# EAGLE design Dual_line_PS (EAGLE 9.6.2)
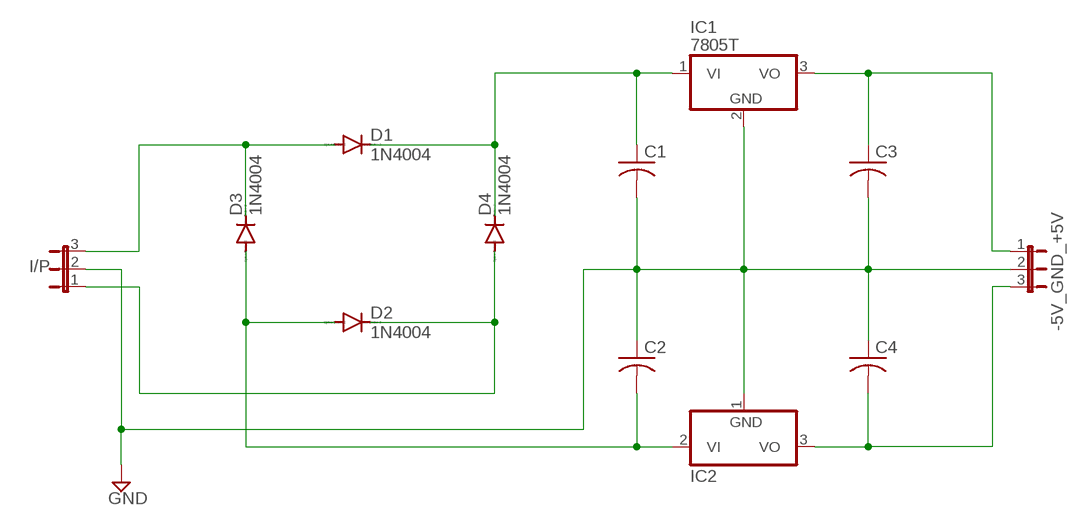
[diagram p0: schematic, sheet 1]

## Parts
-5V_GND_+5V  JP2E  [JP2]
C1  C-US025-024X044  [C025-024X044]
C2  C-US025-024X044  [C025-024X044]
C3  C-US025-024X044  [C025-024X044]
C4  C-US025-024X044  [C025-024X044]
D1  1N4004  [DO41-10]
D2  1N4004  [DO41-10]
D3  1N4004  [DO41-10]
D4  1N4004  [DO41-10]
I/P  JP2E  [JP2]
IC1  7805T  [TO220H]
IC2  7905T  [TO220H]

## Nets
GND: -5V_GND_+5V.2 C1.2 C2.1 C3.2 C4.1 I/P.2 IC1.2(GND) IC2.1(GND)
N$1: D1.A D3.C I/P.3
N$3: D2.C D4.A I/P.1
N$4: C2.2 D2.A D3.A IC2.2(VI)
N$7: C1.1 D1.C D4.C IC1.1(VI)
N$9: -5V_GND_+5V.3 C4.2 IC2.3(VO)
N$10: -5V_GND_+5V.1 C3.1 IC1.3(VO)

## Library data of the parts
-5V_GND_+5V I/P = jumper:JP2E: JUMPER
C1-C4 = rcl:C-US: CAPACITOR, American symbol; SPICEPREFIX: C
D1-D4 = diode:1N4004: DIODE general purpose rectifier, 1 A
IC1 = linear:78*: Positive VOLTAGE REGULATOR Source: http://cache.national.com/ds/LM/LM78L05.pdf http://www.fairchildsemi.com/ds/LM/LM7805.pdf
IC2 = linear:79*: Negative VOLTAGE REGULATOR

## Board
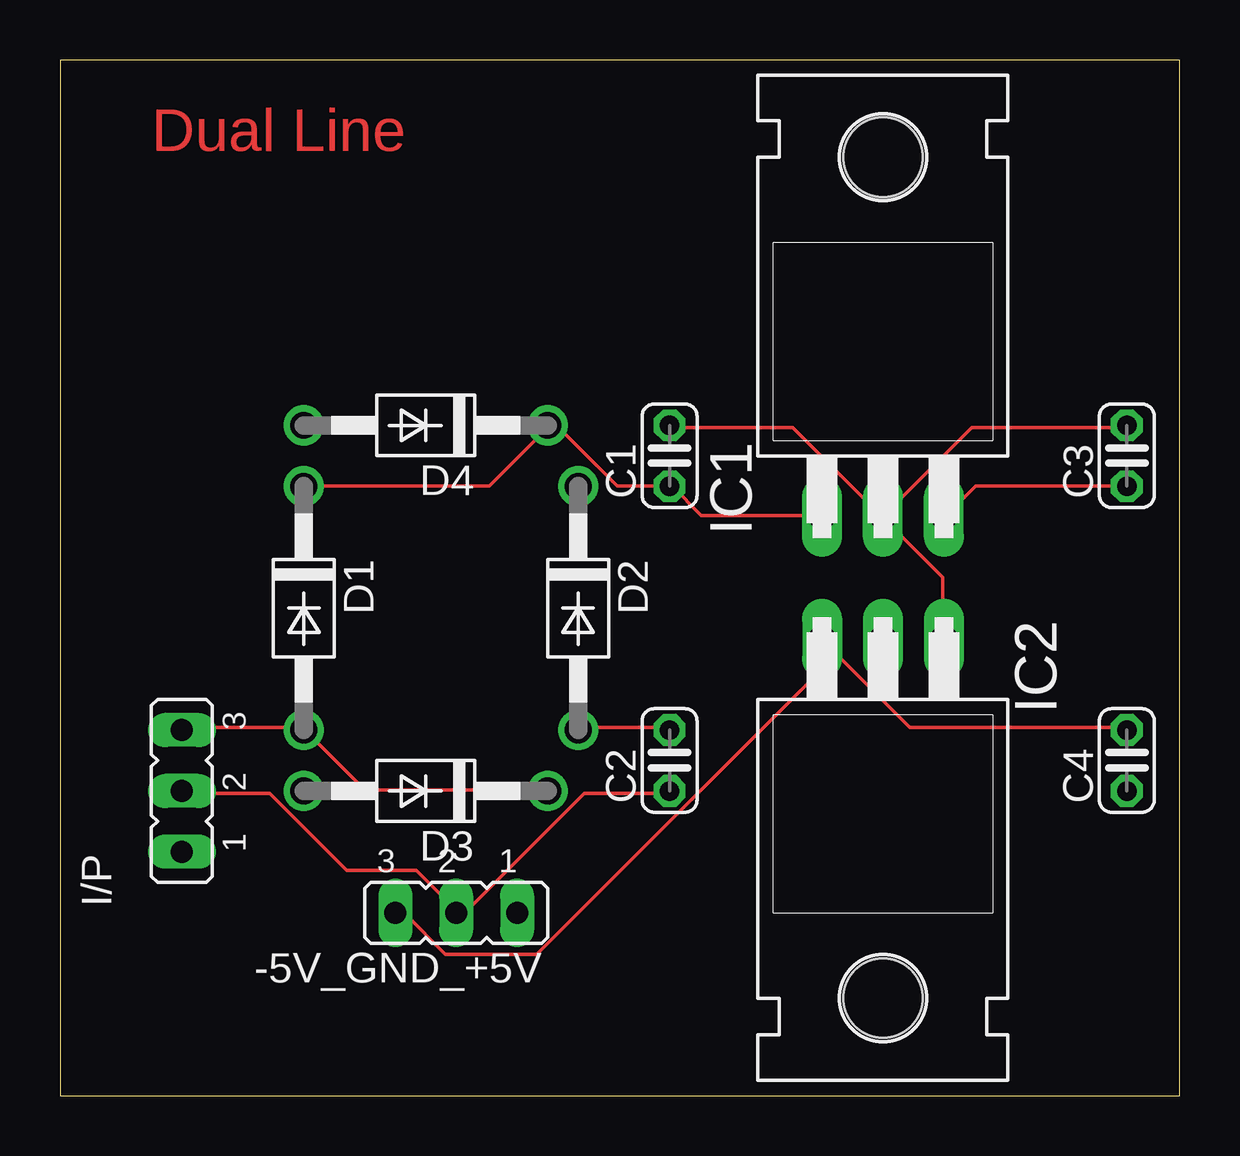
[diagram p1: board, top side]
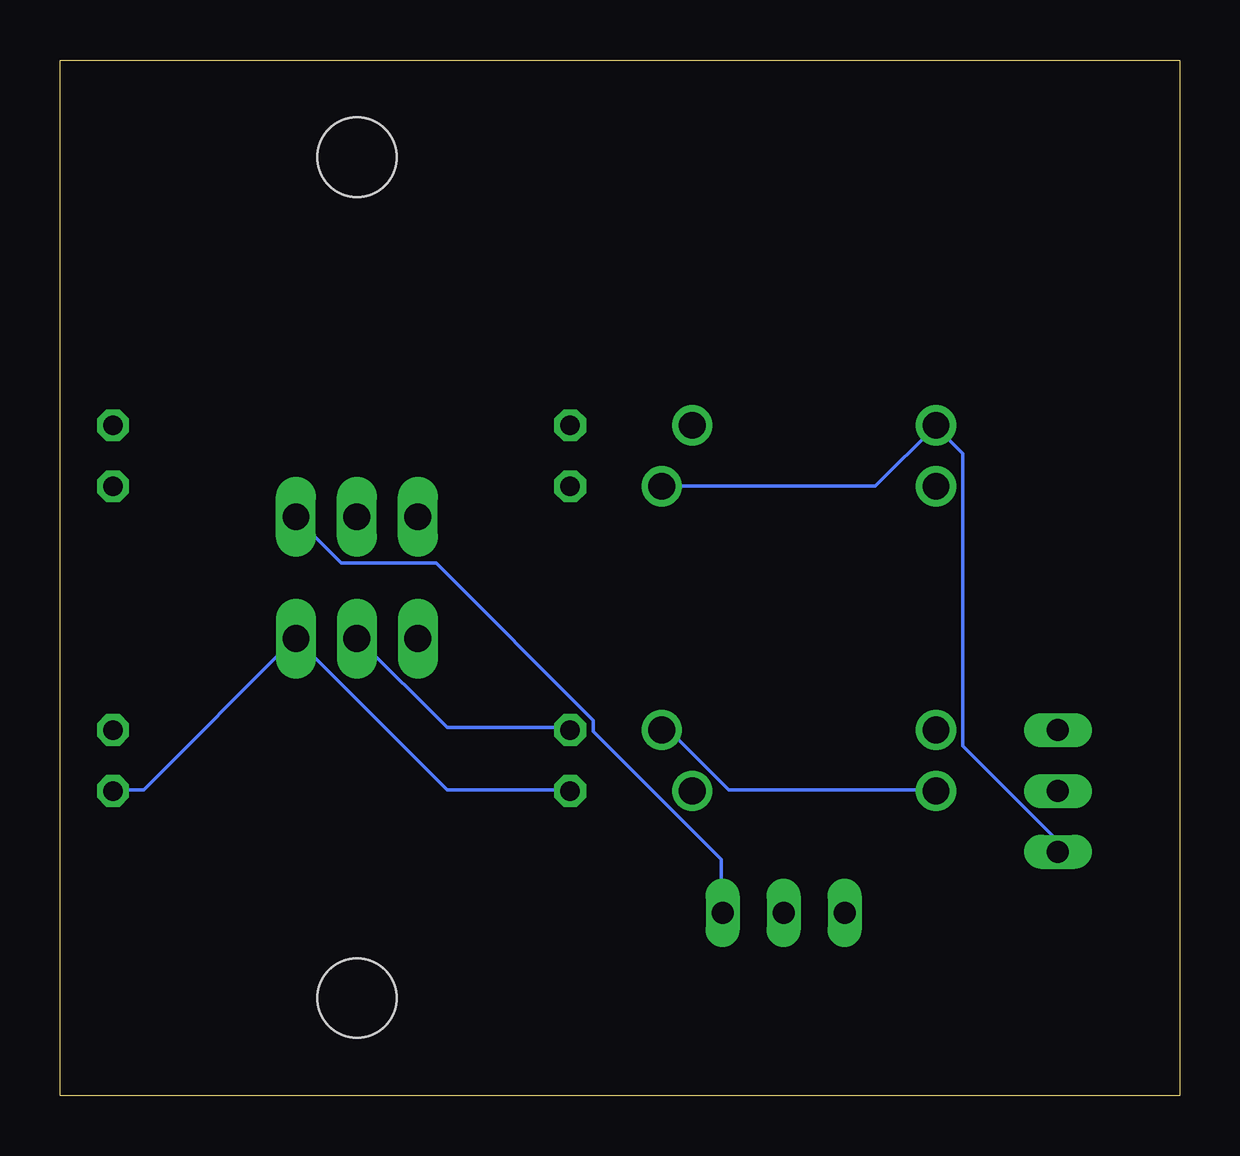
[diagram p2: board, bottom side, seen from below]

Size 46.66 x 43.17 mm. Coordinates in mm from the lower left corner, seen from the top.
Outline: 0,0 46.66,0 46.66,43.17 0,43.17 0,0
Copper layers (1*16): Top 0.035mm / dielectric 1.5mm / Bottom 0.035mm
Design rules "default": minimum track width 6mil, minimum drill 0.35mm, track to track 6mil, track to pad 6mil, pad to pad 6mil, via to via 6mil, smd to smd 6mil, copper to edge 40mil, drill to drill 6mil, minimum pad ring 10mil, minimum via ring 8mil, stop-mask expansion 4mil, vias tented up to drill 0mil, thermal gap 10mil

### Footprints (pad centres in the part's own frame; a part is rotated, then mirrored left to right if it is on the bottom)
JP2 = drill 0.914 long: 1 -2.54,0; 2 0,0; 3 2.54,0
C025-024X044 = drill 0.813 octagon: 1 -1.27,0; 2 1.27,0
DO41-10 = drill 1.118: A 5.08,0; C -5.08,0
TO220H = drill 1.118 long: 1 -2.54,-10.16; 2 0,-10.16; 3 2.54,-10.16 | hole 3.302: 0,4.826

### Placement (x,y rotation side)
-5V_GND_+5V  16.51,7.62 180 top
C1  25.4,26.67 90 top
C2  25.4,13.97 90 top
C3  44.45,26.67 90 top
C4  44.45,13.97 90 top
D1  10.16,20.32 270 top
D2  21.59,20.32 270 top
D3  15.24,12.7 180 top
D4  15.24,27.94 180 top
I/P  5.08,12.7 90 top
IC1  34.29,34.29 0 top
IC2  34.29,8.89 180 top

### Tracks (layer width: path | path; a pad name or v marks a point on that pad's centre or on a via)
GND
  Top 0.152: 16.51,7.72 16.97,7.72 21.84,12.6 25.35,12.6 C2.1 | 16.51,7.72 14.83,9.4 11.94,9.4 8.74,12.6 5.08,12.6 I/P.2 | 16.51,7.72 -5V_GND_+5V.2 | C1.2 25.5,27.84 30.53,27.84 34.19,24.18 IC1.2 | IC1.2 38,27.84 44.4,27.84 C3.2 | IC2.1 36.78,19.15 36.78,21.59 34.34,24.03 IC1.2
  Bottom 0.152: C4.1 44.4,12.75 43.18,12.75 36.93,19 IC2.1 30.53,12.75 25.5,12.75 C2.1
N$1
  Top 0.152: I/P.3 5.08,15.34 10.11,15.34 D1.A 10.26,15.19 12.7,12.75 20.32,12.75 D3.C
N$3
  Bottom 0.152: I/P.1 5.08,10.62 9.04,14.58 9.04,26.77 10.11,27.84 D4.A 12.7,25.4 D2.C
N$4
  Top 0.152: C2.2 25.35,15.34 21.69,15.34 D2.A
  Bottom 0.152: D3.A 10.26,12.75 18.8,12.75 21.23,15.19 21.54,15.19 D2.A | IC2.2 34.19,19 30.53,15.34 25.5,15.34 C2.2
N$7
  Top 0.152: 20.32,27.84 20.78,27.84 23.22,25.4 C1.1 25.5,25.4 26.72,24.18 31.75,24.18 IC1.1 | D1.C 17.88,25.4 20.32,27.84 | 20.32,27.84 D4.C
N$9
  Top 0.152: 32.36,18.39 31.75,19 IC2.3 32.36,18.39 | 32.36,18.39 35.41,15.34 44.4,15.34 C4.2 | 32.36,18.39 19.86,5.89 16.05,5.89 14.38,7.57 14.07,7.57 -5V_GND_+5V.3
N$10
  Top 0.152: C3.1 38.15,25.4 36.93,24.18 IC1.3
  Bottom 0.152: -5V_GND_+5V.1 19.1,7.72 19.1,9.86 24.44,15.19 24.44,15.65 30.99,22.2 34.95,22.2 36.78,24.03 IC1.3

### Text on the board
Top: Dual Line